# Altium schematic sheet STM32_SIM800.SchDoc
size A2
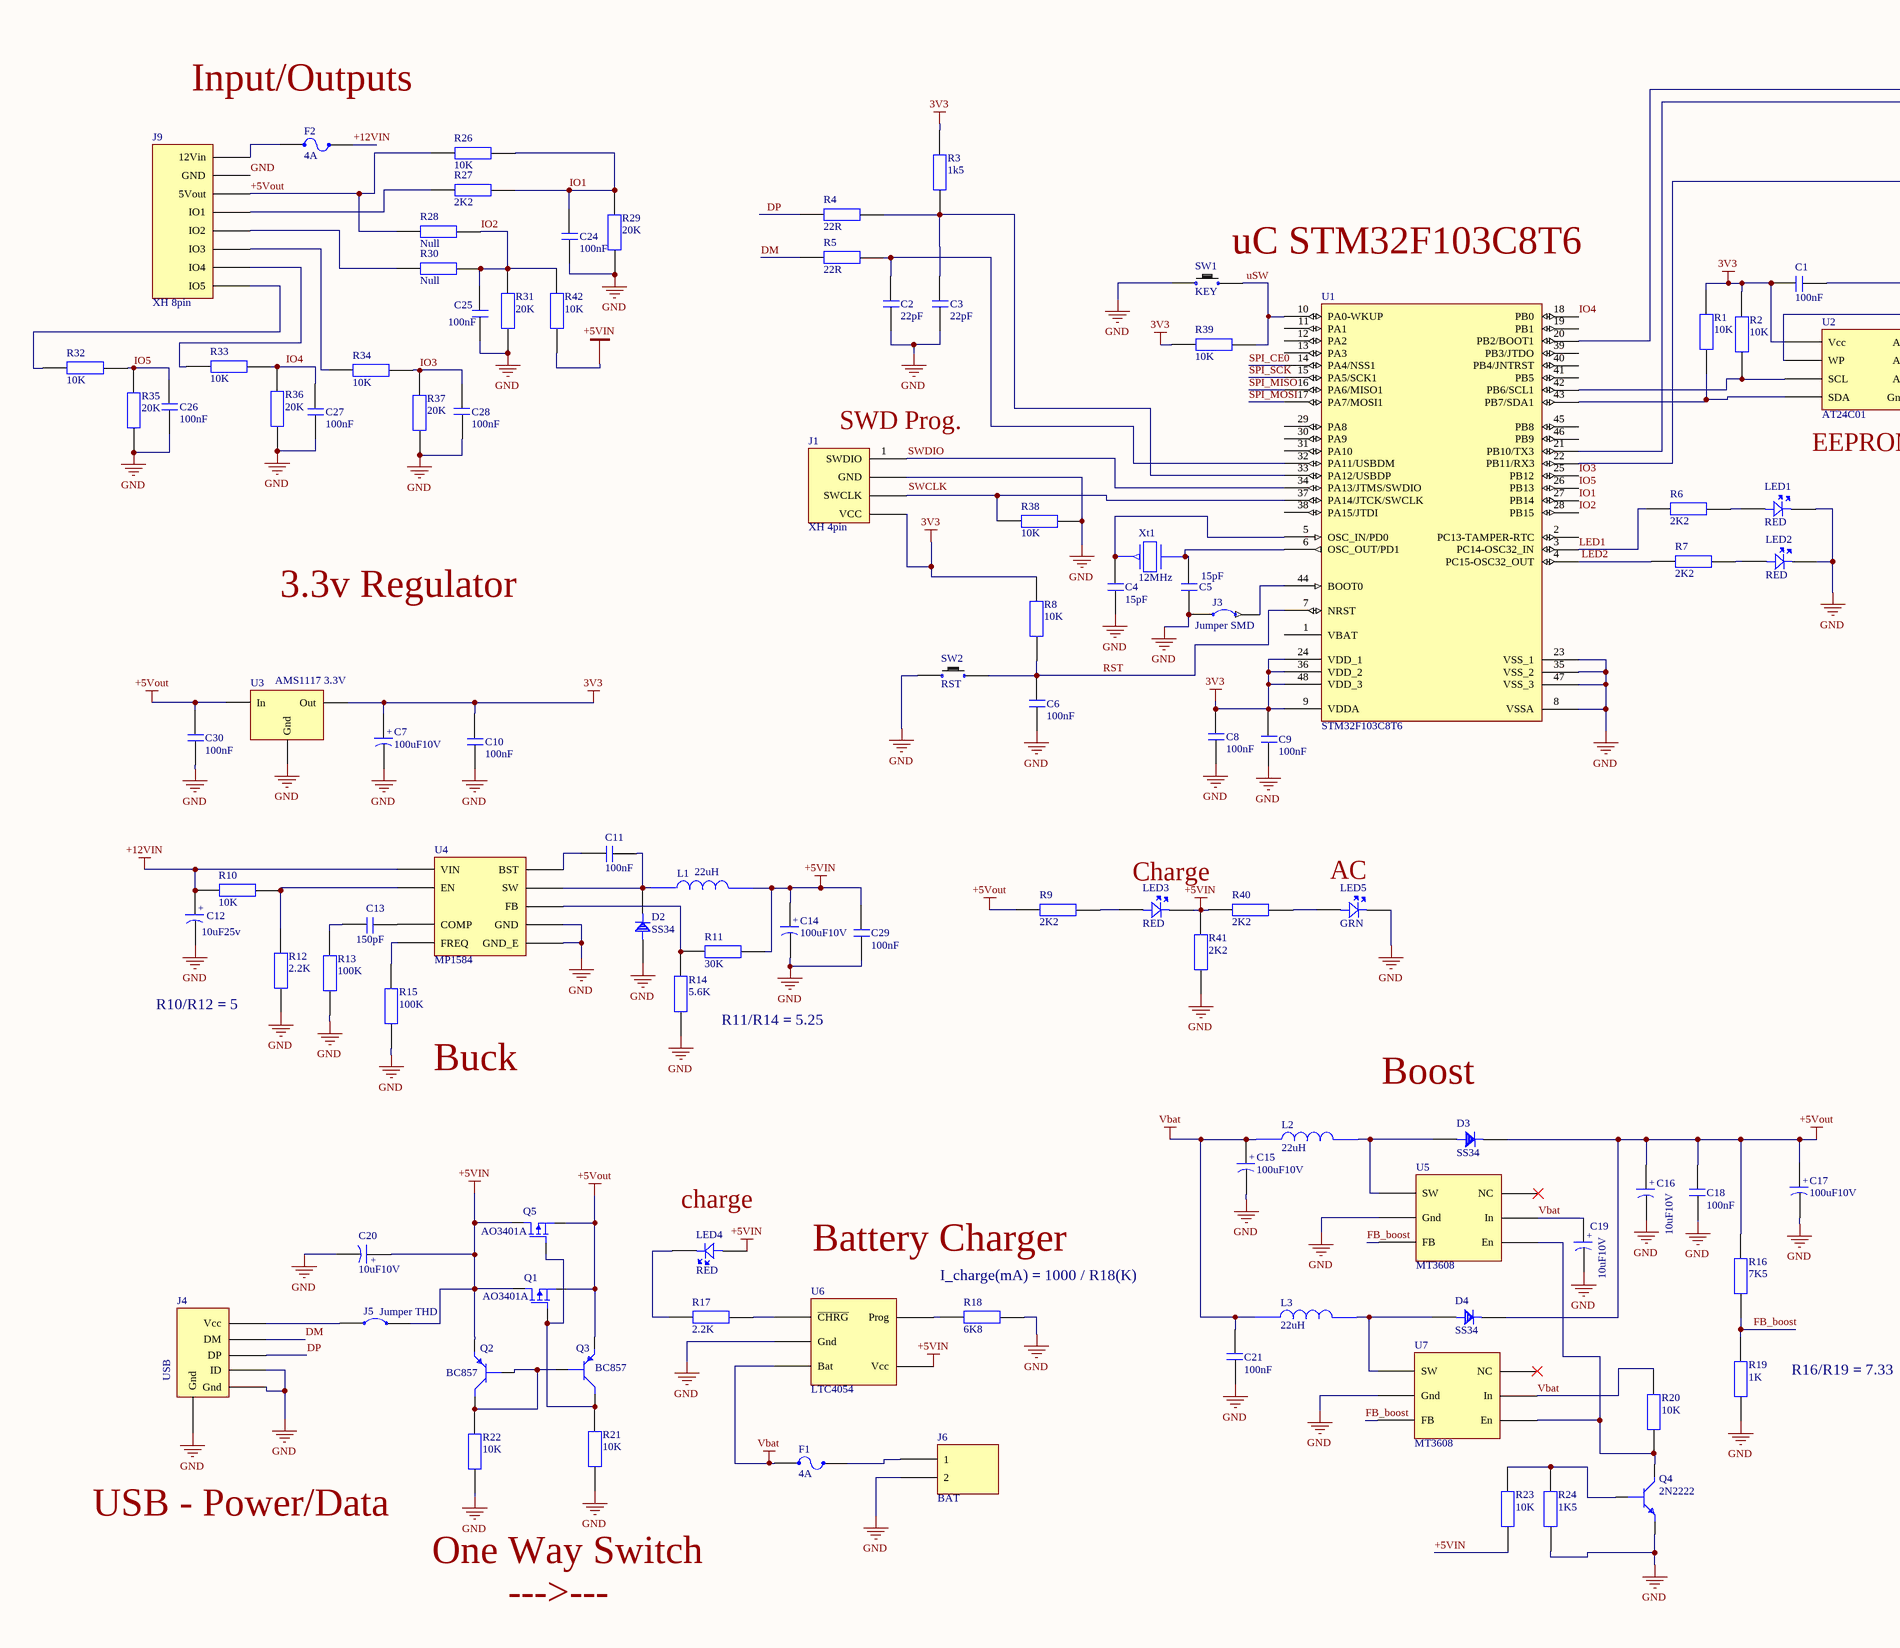
[diagram p0: STM32_SIM800.SchDoc, left]
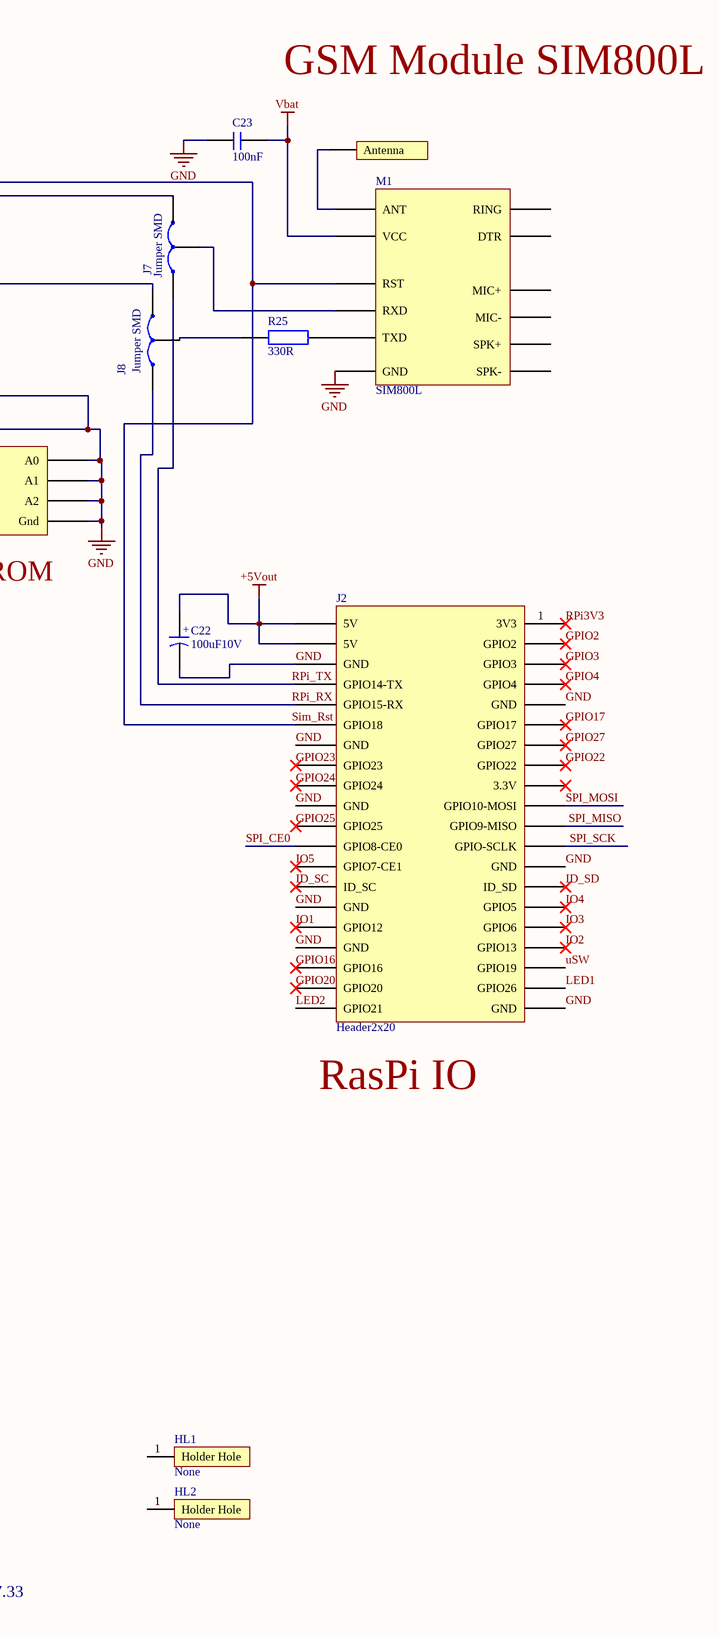
[diagram p1: STM32_SIM800.SchDoc, right]

## Parts
C1  100nF  [CAP_0805]
C2  22pF  [CAP_0805]
C3  22pF  [CAP_0805]
C4  15pF  [CAP_0805]
C5  15pF  [CAP_0805]
C6  100nF  [CAP_0805]
C7  100uF10V  [Cap_Tan_Size_B]
C8  100nF  [CAP_0805]
C9  100nF  [CAP_0805]
C10  100nF  [CAP_0805]
C11  100nF  [CAP_0805]
C12  10uF25v  [Cap_Tan_Size_B]
C13  150pF  [CAP_0805]
C14  100uF10V  [Cap_Tan_Size_B]
C15  100uF10V  [Cap_Tan_Size_B]
C16  10uF10V  [Cap_Tan_Size_B]
C17  100uF10V  [Cap_Tan_Size_B]
C18  100nF  [CAP_0805]
C19  10uF10V  [Cap_Tan_Size_B]
C20  10uF10V  [Cap_Tan_Size_B]
C21  100nF  [CAP_0805]
C22  100uF10V  [Cap_Tan_Size_B]
C23  100nF  [CAP_0805]
C24  100nF  [CAP_0805]
C25  100nF  [CAP_0805]
C26  100nF  [CAP_0805]
C27  100nF  [CAP_0805]
C28  100nF  [CAP_0805]
C29  100nF  [CAP_0805]
C30  100nF  [CAP_0805]
D2  SS34  [Diode_SMA]
D3  SS34  [Diode_SMA]
D4  SS34  [Diode_SMA]
F1  4A  [fuse_1206]
F2  4A  [fuse_1206]
HL1  None  [Holder_hole]  (no BOM)
HL2  None  [Holder_hole]  (no BOM)
J1  XH 4pin  [XH-4pin]
J2  Header2x20  [Header_2x20_female]
J3  Jumper SMD  [Jumper_smd]  (no BOM)
J4  USB  [Micro_USB_smd]
J5  Jumper THD  [Jumper_2pin]
J6  BAT  [XH-2pin]
J7  Jumper SMD  [Jumper_smd_3pin]  (no BOM)
J8  Jumper SMD  [Jumper_smd_3pin]  (no BOM)
J9  XH 8pin  [XH-8pin - RA]
L1  22uH  [L_10x10]
L2  22uH  [L_10x10]
L3  22uH  [L_10x10]
LED1  RED  [LED_0805_Red]
LED2  RED  [LED_0805_Red]
LED3  RED  [LED_0805_Red]
LED4  RED  [LED_0805_Red]
LED5  GRN  [LED_0805_Red]
M1  SIM800L  [SIM800L]
Q1  AO3401A  [SOT23 - P-Channel]
Q2  BC857  [SOT23-PNP]
Q3  BC857  [SOT23-PNP]
Q4  2N2222  [SOT23-NPN]
Q5  AO3401A  [SOT23 - P-Channel]
R1  10K  [RES_0805]
R2  10K  [RES_0805]
R3  1k5  [RES_0805]
R4  22R  [RES_0805]
R5  22R  [RES_0805]
R6  2K2  [RES_0805]
R7  2K2  [RES_0805]
R8  10K  [RES_0805]
R9  2K2  [RES_0805]
R10  10K  [RES_0805]
R11  30K  [RES_0805]
R12  2.2K  [RES_0805]
R13  100K  [RES_0805]
R14  5.6K  [RES_0805]
R15  100K  [RES_0805]
R16  7K5  [RES_0805]
R17  2.2K  [RES_0805]
R18  6K8  [RES_0805]
R19  1K  [RES_0805]
R20  10K  [RES_0805]
R21  10K  [RES_0805]
R22  10K  [RES_0805]
R23  10K  [RES_0805]
R24  1K5  [RES_0805]
R25  330R  [RES_0805]
R26  10K  [RES_0805]
R27  2K2  [RES_0805]
R28  Null  [RES_0805]
R29  20K  [RES_0805]
R30  Null  [RES_0805]
R31  20K  [RES_0805]
R32  10K  [RES_0805]
R33  10K  [RES_0805]
R34  10K  [RES_0805]
R35  20K  [RES_0805]
R36  20K  [RES_0805]
R37  20K  [RES_0805]
R38  10K  [RES_0805]
R39  10K  [RES_0805]
R40  2K2  [RES_0805]
R41  2K2  [RES_0805]
R42  10K  [RES_0805]
SW1  KEY  [Tact_SW_SMD]
SW2  RST  [Tact_SW_SMD]
TP1  Ant.  [TP]  (value not drawn)  (no BOM)
U1  STM32F103C8T6  [STM32F103C8-LQFP-48]
U2  AT24C01  [AT24C01_SOP8]
U3  AMS1117 3.3V  [AMS1117-SOT223]
U4  MP1584  [MP1584-SOP8]
U5  MT3608  [MT3608_SOT23-6]
U6  LTC4054  [LTC4054-4.2_SOT23-5]
U7  MT3608  [MT3608_SOT23-6]
Xt1  12MHz  [Xtal_SMD]

## Nets
3V3: C1.1 C7.+ C8.2 C9.2 C10.2 J1.4(VCC) R1.2 R2.2 R3.2 R8.2 R39.1 U1.9(VDDA) U1.24(VDD_1) U1.36(VDD_2) U1.48(VDD_3) U2.8(Vcc) U3.3(Out)
+5VIN: C14.+ C20.+ C29.2 J5.1 L1.2 LED3.2 LED4.1 Q1.D Q2.E Q5.D R11.1 R23.2 R40.2 R41.1 R42.2 U6.VCC(Vcc)
+5Vout: C16.+ C17.+ C18.1 C22.+ C30.2 D3.K D4.K J2.2(5V) J2.4(5V) J9.3(5Vout) Q1.S Q3.E Q5.S R9.2 R16.2 R26.1 R28.1 U3.1(In)
+12VIN: C12.+ F2.1 R10.1 U4.VIN
GND: C1.2 C2.1 C3.1 C4.1 C5.1 C6.1 C7.- C8.1 C9.1 C10.1 C12.- C14.- C15.- C16.- C17.- C18.2 C19.- C20.- C21.2 C22.- C23.1 C24.1 C25.1 C26.1 C27.1 C28.2 C29.1 C30.1 D2.A J1.2(GND) J2.6(GND) J2.9(GND) J2.14(GND) J2.20(GND) J2.25(GND) J2.30(GND) J2.34(GND) J2.39(GND) J3.2 J4.4(ID) J4.5(Gnd) J4.6(Gnd) J6.2 J9.2(GND) LED1.2 LED2.2 LED5.2 M1.GND Q4.E R12.1 R13.2 R14.1 R15.1 R18.2 R19.1 R21.1 R22.1 R24.2 R29.2 R31.2 R35.2 R36.2 R37.2 R38.2 R41.2 SW1.1 SW2.2 U1.8(VSSA) U1.23(VSS_1) U1.35(VSS_2) U1.47(VSS_3) U2.1(A0) U2.2(A1) U2.3(A2) U2.4(Gnd) U2.7(WP) U3.2(Gnd) U4.GND U4.GND_E U5.GND(Gnd) U6.GND(Gnd) U7.GND(Gnd)
Vbat: C15.+ C19.+ C21.1 C23.2 F1.2 L2.1 L3.1 M1.VCC R20.1 U5.IN(In) U6.BAT(Bat) U7.IN(In)
DM: J4.2(DM) R5.2
DP: J4.3(DP) R4.2
FB_boost: R16.1 R19.2 U5.FB U7.FB
GPIO2: J2.3(GPIO2)
GPIO3: J2.5(GPIO3)
GPIO4: J2.7(GPIO4)
GPIO16: J2.36(GPIO16)
GPIO17: J2.11(GPIO17)
GPIO20: J2.38(GPIO20)
GPIO22: J2.15(GPIO22)
GPIO23: J2.16(GPIO23)
GPIO24: J2.18(GPIO24)
GPIO25: J2.22(GPIO25)
GPIO27: J2.13(GPIO27)
ID_SC: J2.28(ID_SC)
ID_SD: J2.27(ID_SD)
IO1: C24.2 J2.32(GPIO12) R26.2 R27.1 R29.1 U1.27(PB14)
IO2: C25.2 J2.33(GPIO13) R28.2 R30.1 R31.1 R42.1 U1.28(PB15)
IO3: C28.1 J2.31(GPIO6) R34.1 R37.1 U1.25(PB12)
IO4: C27.2 J2.29(GPIO5) R33.1 R36.1 U1.18(PB0)
IO5: C26.2 J2.26(GPIO7-CE1) R32.1 R35.1 U1.26(PB13)
LED1: J2.37(GPIO26) R6.1 U1.3(PC14-OSC32_IN)
LED2: J2.40(GPIO21) R7.1 U1.4(PC15-OSC32_OUT)
RPi3V3: J2.1(3V3)
RPi_RX: J2.10(GPIO15-RX) J8.1
RPi_TX: J2.8(GPIO14-TX) J7.1
RST: C6.2 R8.1 SW2.1 U1.7(NRST)
Sim_Rst: J2.12(GPIO18) M1.RST U1.20(PB2/BOOT1)
SPI_CE0: J2.24(GPIO8-CE0) U1.14(PA4/NSS1)
SPI_MISO: J2.21(GPIO9-MISO) U1.16(PA6/MISO1)
SPI_MOSI: J2.19(GPIO10-MOSI) U1.17(PA7/MOSI1)
SPI_SCK: J2.23(GPIO-SCLK) U1.15(PA5/SCK1)
SWDIO: J1.1(SWDIO) U1.34(PA13/JTMS/SWDIO)
uSW: J2.35(GPIO19) R39.2 SW1.2 U1.10(PA0-WKUP)
NetC2_2: C2.2 R5.1 U1.32(PA11/USBDM)
NetC3_2: C3.2 R3.1 R4.1 U1.33(PA12/USBDP)
NetC4_2: C4.2 U1.5(OSC_IN/PD0) Xt1.1
NetC5_2: C5.2 U1.6(OSC_OUT/PD1) Xt1.2
NetC11_1: C11.1 U4.BST
NetC11_2: C11.2 D2.K L1.1 U4.SW
NetC13_1: C13.1 R13.1
NetC13_2: C13.2 U4.COMP
NetD3_A: D3.A L2.2 U5.SW
NetD4_A: D4.A L3.2 U7.SW
NetF1_1: F1.1 J6.1
NetF2_2: F2.2 J9.1(12Vin)
NetJ1_3: J1.3(SWCLK) R38.1 U1.37(PA14/JTCK/SWCLK)
NetJ3_1: J3.1 U1.44(BOOT0)
NetJ4_1: J4.1(Vcc) J5.2
NetJ7_2: J7.2 M1.RXD
NetJ7_3: J7.3 U1.21(PB10/TX3)
NetJ8_2: J8.2 R25.1
NetJ8_3: J8.3 U1.22(PB11/RX3)
NetJ9_4: J9.4(IO1) R27.2
NetJ9_5: J9.5(IO2) R30.2
NetJ9_6: J9.6(IO3) R34.2
NetJ9_7: J9.7(IO4) R33.2
NetJ9_8: J9.8(IO5) R32.2
NetLED1_1: LED1.1 R6.2
NetLED2_1: LED2.1 R7.2
NetLED3_1: LED3.1 R9.1
NetLED4_2: LED4.2 R17.1
NetLED5_1: LED5.1 R40.1
NetM1_ANT: M1.ANT TP1.1(Antenna)
NetM1_TXD: M1.TXD R25.2
NetQ1_G: Q1.G Q3.C Q5.G R21.2
NetQ2_B: Q2.B Q2.C Q3.B R22.2
NetQ4_B: Q4.B R23.1 R24.1
NetQ4_C: Q4.C R20.2 U5.EN(En) U7.EN(En)
NetR1_1: R1.1 U1.43(PB7/SDA1) U2.5(SDA)
NetR2_1: R2.1 U1.42(PB6/SCL1) U2.6(SCL)
NetR10_2: R10.2 R12.2 U4.EN
NetR11_2: R11.2 R14.2 U4.FB
NetR15_2: R15.2 U4.FREQ
NetR17_2: R17.2 U6.CHRG(~{CHRG})
NetR18_1: R18.1 U6.PROG(Prog)

Not connected (* = marked no-connect by the designer): HL1 1(Holder_Hole); HL2 1(Holder_Hole); J2 17(3.3V)*; M1 DTR MIC+ MIC- RING SPK+ SPK-; U1 1(VBAT) 2(PC13-TAMPER-RTC) 11(PA1) 12(PA2) 13(PA3) 19(PB1) 29(PA8) 30(PA9) 31(PA10) 38(PA15/JTDI) 39(PB3/JTDO) 40(PB4/JNTRST) 41(PB5) 45(PB8) 46(PB9); U5 NC*; U7 NC*

## Notes on the sheet
- GSM Module SIM800L
- Input/Outputs
- (near SW1) uC STM32F103C8T6
- (near J1) SWD Prog.
- (near U2) EEPROM
- 3.3v Regulator
- Charge
- (near LED5) AC
- (near J2) RasPi IO
- (near R12) R10/R12 = 5
- R11/R14 = 5.25
- (near R15) Buck
- Boost
- (near LED4) charge
- Battery Charger
- (near R18) I_charge(mA) = 1000 / R18(K)
- R16/R19 = 7.33
- USB - Power/Data
- One Way Switch
- --->---
- Labels drawn without touching a wire or pin: SWCLK

## Library data of the parts
C1-C6 C8-C11 C13 C18 C21 C23-C30 = Cap0805: Capacitor SMD 0805
C7 C12 C14-C17 C19 C20 C22 = Cap_Tant_B: Capacitor SMD Tantalium Size B
D2-D4 = Diode_SMA: Diode SMD Shotkey 1N5822 SS34
F1 F2 = Fuse1206: Fuse SMD 1206
HL1 HL2 = Holder_Hole: PCB Holder Hole
J1 = Con_XH_4pin: Connector XH Female 4-pin
J2 = Header2x20: Pin Header 2x20 pitch=2.54mm
J3 = Jump_smd
J4 = MicroUSB_SMD: Micro USB Female connector SMD; pin to pad: 1>VUSB 2>DM 3>DP 4>ID 5>Gnd 6>G
J5 = Jumper DIP: Jumper pin header + jumper 2pin pirch=2.54mm
J6 = Con_XH_2pin: Connector XH Female 2-pin
J7 J8 = Jump_smd_3tap
J9 = Con_XH_8pin: Connector XH Female 8-pin
L1-L3 = Inductor_10x10: SMD Power Inductor 10X10mm
LED1-LED5 = LED_0805_Red: LED SMD 0805 Red
M1 = SIM800L: SIM800L GSM Module
Q1 Q5 = Mosfet_P_SOT23: MOSFET P-Channel SMD SOT23
Q2 Q3 = BJT PNP SOT23: PNP Transistor SMD SOT23
Q4 = BJT_NPN_SOT23: NPN Transistor SMD SOT23
R1-R42 = Res0805: Resistor SMD 0805
SW1 SW2 = Tact_sw: Tact switch SMD 2pin
TP1 = TP: Test point
U1 = STM32F103C8T6: STM32 ARM-based 32-bit MCU with 64 Kbytes Flash, 48-pin LQFP, Industrial Temperature; pin to pad: 1>VBAT 2>PC13 3>PC14 4>PC15 5>OSC_IN 6>OSC_OUT 7>NRST 8>VSSA 9>VDDA 10>PA0 11>PA1 12>PA2 13>PA3 14>PA4 15>PA5 16>PA6 17>PA7 18>PB0 19>PB1 20>PB2 21>PB10 22>PB11 23>VSS_1 24>VDD_1 25>PB12 26>PB13 27>PB14 28>PB15 29>PA8 30>PA9 31>PA10 32>PA11 33>PA12 34>PA13 35>VSS_2 36>VDD_2 37>PA14 38>PA15 39>PB3 40>PB4 41>PB5 42>PB6 43>PB7 44>BOOT0 45>PB8 46>PB9 47>VSS_3 48>VDD_3; Published: 30-May-2008; DatasheetVersion: rev6, Mar-2008; PackageVersion: Mar-2008; PackageReference: LQFP48; Publisher: Altium Limited; PackageDescription: 48-Pin Low-Profile Quad Flat Pack, 7 x 7 mm Body, 0.5 mm Pitch (LQFP48); ComponentLink1Description: Manufacturer Link; ComponentLink1URL: www.st.com/stm32; ComponentLink2Description: Datasheet; ComponentLink2URL: http://www.st.com/stonline/products/literature/ds/13587.pdf
U2 = AT24C01: AT24C01 EEPROM SMD SO8; pin to pad: 1>A0 2>A1 3>A2 4>Gnd 5>SDA 6>SCL 7>WP 8>Vcc
U3 = AMS1117-SOT223: AMS1117 Regulator 3.3V SMD SOT223; pin to pad: 1>In 2>Gnd_Adj 3>Out
U4 = MP1584: BUCK SMD SO8
U5 U7 = MT3608: Boost switching
U6 = LTC4054-4.2: Li-Ion Battery charger
Xt1 = Xtal_SMD: Crystal Oscillator SMD